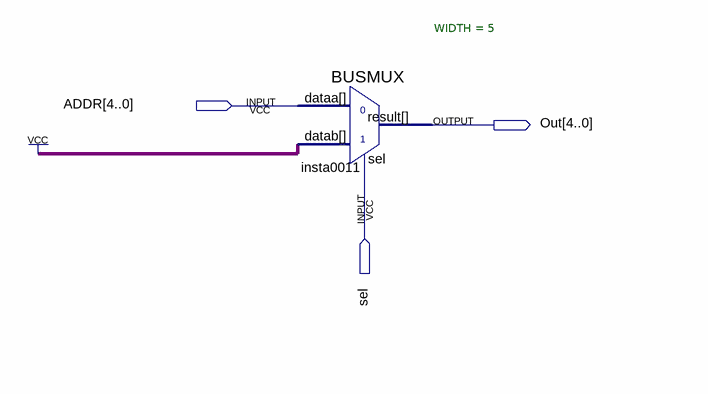
[diagram p0: schematic sheet]
// Quartus schematic MuxADDR.bdf as structural Verilog: 1 symbols, 3 pins
module MuxADDR (
  input  [4:0] ADDR,
  input  sel,
  output [4:0] Out
);

  BUSMUX #(.WIDTH(5)) insta0011 (.datab({5{1'b1}}), .sel(sel), .dataa(ADDR), .result(Out));
endmodule
